# Altium schematic sheet Schenatic_Board.SchDoc
size 431 x 279 mm; SheetNumber: 1; SheetTotal: 1
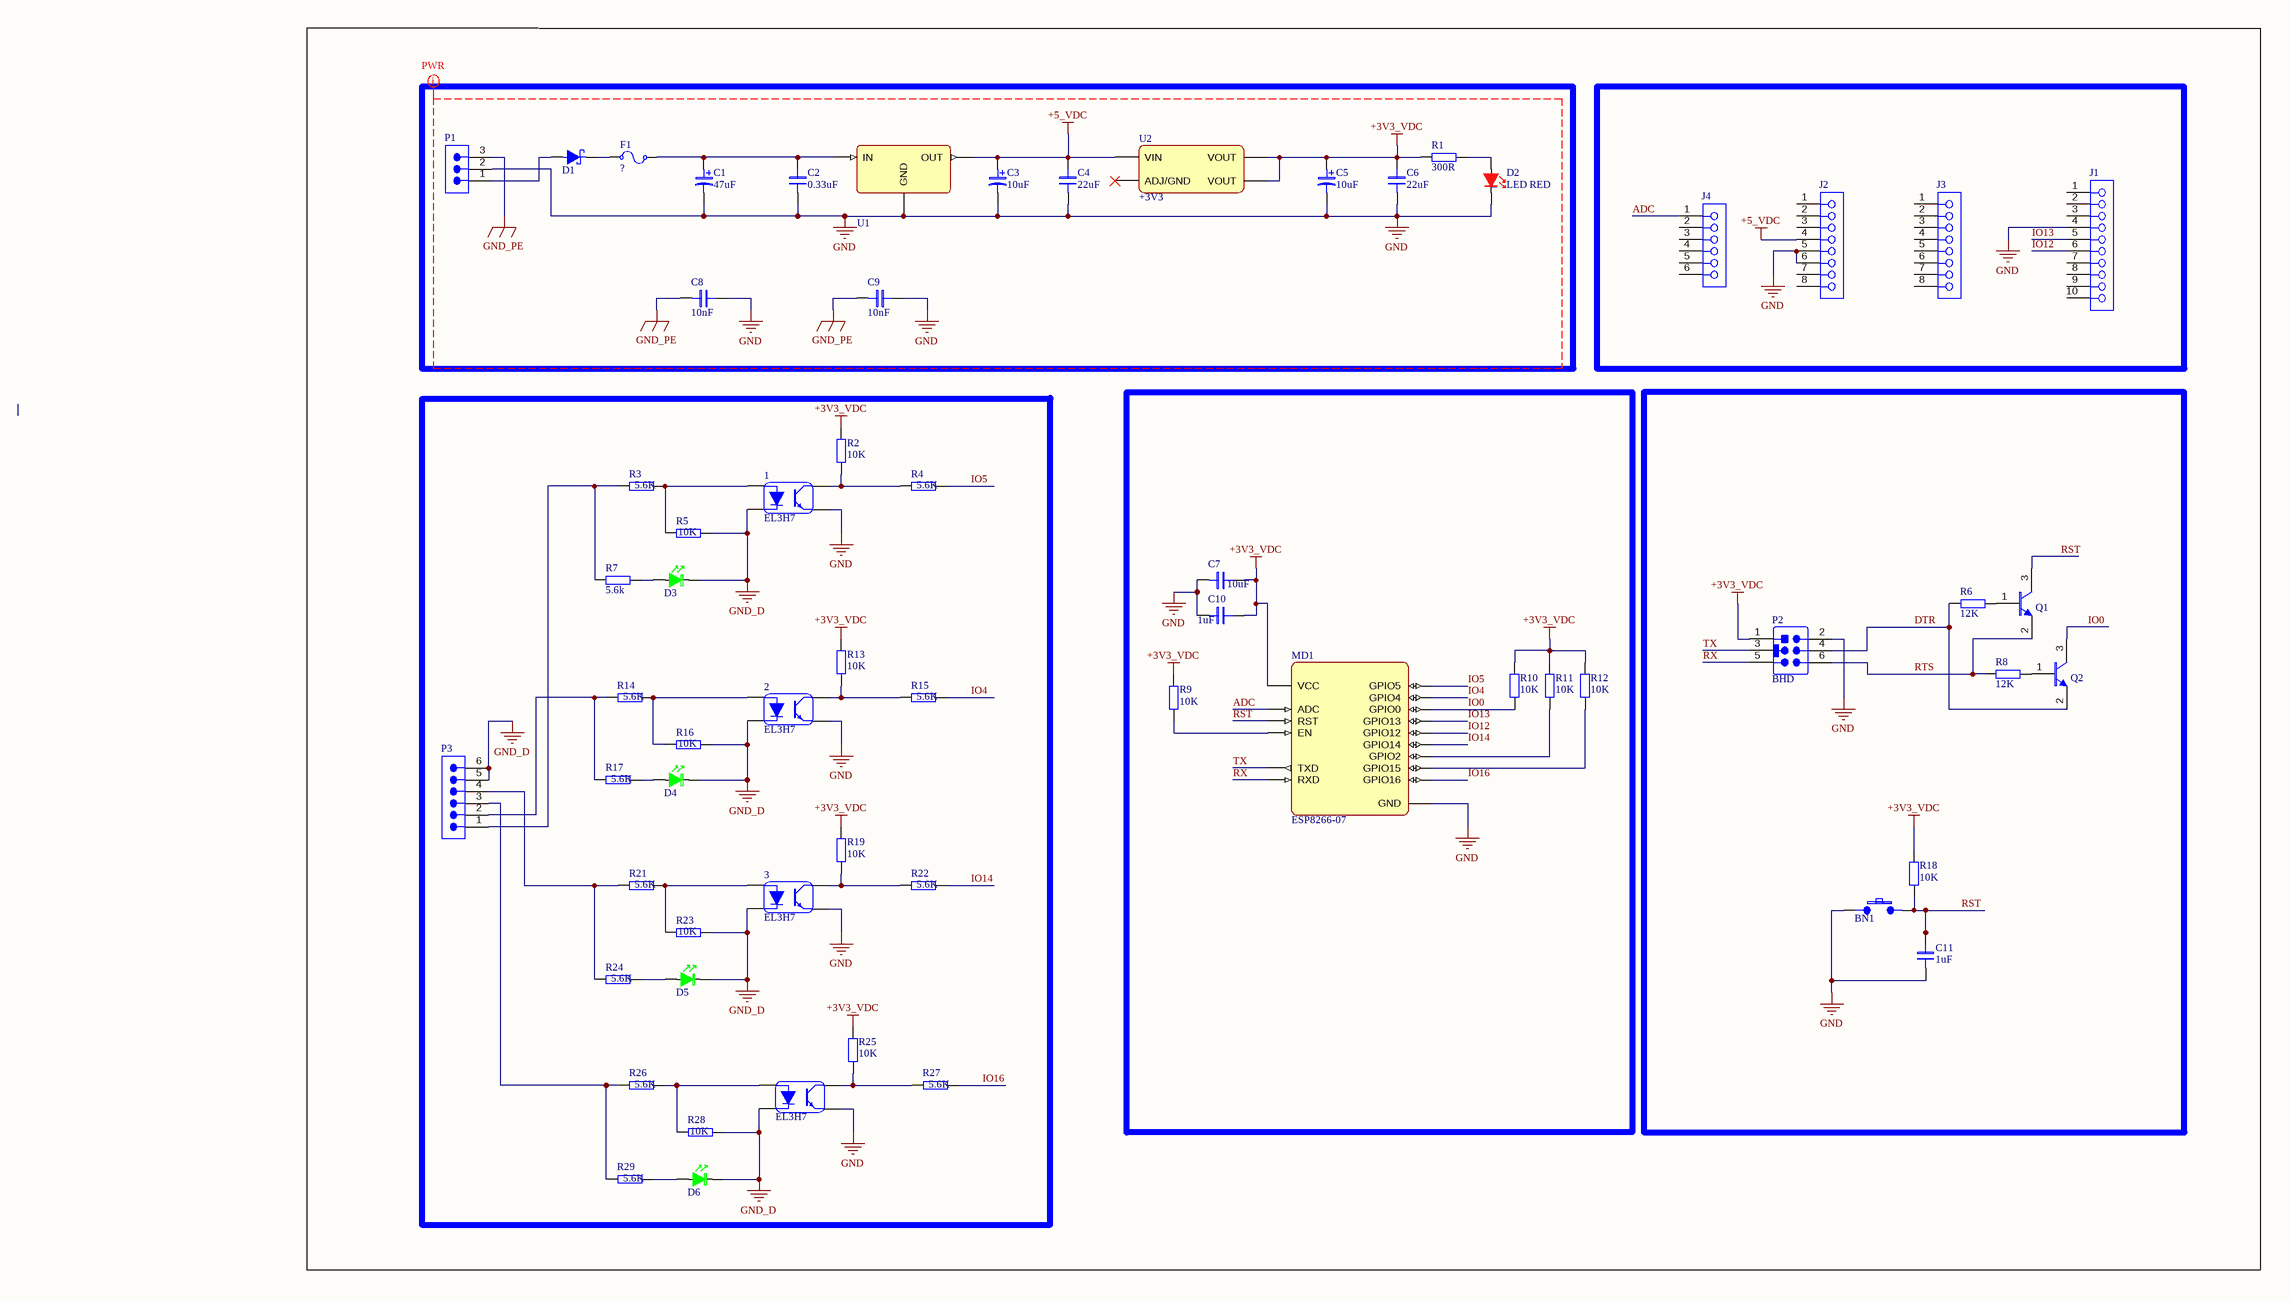
[diagram p0: Schenatic_Board.SchDoc]

## Parts
1  EL3H7  [OPT_EL3H7]
2  EL3H7  [OPT_EL3H7]
3  EL3H7  [OPT_EL3H7]
?  EL3H7  [OPT_EL3H7]
BN1  SKRPABE010  [BTN_SKRPABE010]  (value not drawn)
C1  47uF  [CAPA_D63]
C2  0.33uF  [CAPC_0805]
C3  10uF  [CAPT_1206]
C4  22uF  [CAPC_0805]
C5  10uF  [CAPT_1206]
C6  22uF  [CAPC_0805]
C7  10uF  [CAPC_0805]
C8  10nF  [CAPC_HV10]
C9  10nF  [CAPC_HV10]
C10  1uF  [CAPC_0805]
C11  1uF  [CAPC_0805]
D1  SS34  [DIO-SMA]  (value not drawn)
D2  LED RED  [LED_RED_V0805]
D3  Green LED  [LED-GREEN-3MM]  (value not drawn)
D4  Green LED  [LED-GREEN-3MM]  (value not drawn)
D5  Green LED  [LED-GREEN-3MM]  (value not drawn)
D6  Green LED  [LED-GREEN-3MM]  (value not drawn)
F1  ?  [FUS-PPTC1812]
J1  61301011821  [61301011821]  (value not drawn)
J2  61300811821  [61300811821]  (value not drawn)
J3  61300811821  [61300811821]  (value not drawn)
J4  61300611821  [61300611821]  (value not drawn)
MD1  ESP8266-07  [MD-ESP8266-07]
P1  691322310003  [691322310003]  (value not drawn)
P2  BHD  [CON-BHD-06254-VDM]
P3  691322310006  [691322310006]  (value not drawn)
Q1  BC846x  [BJT_ BC846x]  (value not drawn)
Q2  BC846x  [BJT_ BC846x]  (value not drawn)
R1  300R  [RES_0805]
R2  10K  [RES_0805]
R3  5.6K  [RES_0805]
R4  5.6K  [RES_0805]
R5  10K  [RES_0805]
R6  12K  [RES_0805]
R7  5.6k  [RES_0805]
R8  12K  [RES_0805]
R9  10K  [RES_0805]
R10  10K  [RES_0805]
R11  10K  [RES_0805]
R12  10K  [RES_0805]
R13  10K  [RES_0805]
R14  5.6K  [RES_0805]
R15  5.6K  [RES_0805]
R16  10K  [RES_0805]
R17  5.6K  [RES_0805]
R18  10K  [RES_0805]
R19  10K  [RES_0805]
R21  5.6K  [RES_0805]
R22  5.6K  [RES_0805]
R23  10K  [RES_0805]
R24  5.6K  [RES_0805]
R25  10K  [RES_0805]
R26  5.6K  [RES_0805]
R27  5.6K  [RES_0805]
R28  10K  [RES_0805]
R29  5.6K  [RES_0805]
U1  L7805ACD2T  [L7805ACD2T]  (value not drawn)
U2  +3V3  [LD1117_SOT223]

## Nets
+3V3_VDC: C5.1(P) C6.2 C7.2 C10.2 MD1.8(VCC) P2.1 R1.2 R2.2 R9.2 R10.2 R11.2 R12.2 R13.2 R18.2 R19.2 R25.2 U2.2(VOUT) U2.4(VOUT)
+5_VDC: C3.1(P) C4.2 J2.4 U1.3(OUT) U2.3(VIN)
GND: 1.3 2.3 3.3 ?.3 BN1.12 C1.2(N) C2.1 C3.2(N) C4.1 C5.2(N) C6.1 C7.1 C8.2 C9.2 C10.1 C11.1 D2.C J1.4 J2.5 J2.6 MD1.9(GND) P1.2 P2.2 U1.4(GND)
GND_D: 1.2 2.2 3.2 ?.2 D3.C D4.C D5.C D6.C P3.5 P3.6 R5.2 R16.2 R23.2 R28.2
GND_PE: C8.1 C9.1 P1.3
ADC: J4.1 MD1.2(ADC)
DTR: P2.4 Q2.2(E) R6.2
IO0: MD1.12(GPIO0) Q2.3(C) R10.1
IO4: MD1.13(GPIO4) R15.1
IO5: MD1.14(GPIO5) R4.1
IO12: J1.6 MD1.6(GPIO12)
IO13: J1.5 MD1.7(GPIO13)
IO14: MD1.5(GPIO14) R22.1
IO16: MD1.4(GPIO16) R27.1
RST: BN1.34 C11.2 MD1.1(RST) Q1.3(C) R18.1
RTS: P2.6 Q1.2(E) R8.2
RX: MD1.15(RXD) P2.5
TX: MD1.16(TXD) P2.3
Net1_1: 1.1 R3.1 R5.1
Net1_4: 1.4 R2.1 R4.2
Net2_1: 2.1 R14.1 R16.1
Net2_4: 2.4 R13.1 R15.2
Net3_1: 3.1 R21.1 R23.1
Net3_4: 3.4 R19.1 R22.2
Net?_1: ?.1 R26.1 R28.1
Net?_4: ?.4 R25.1 R27.2
NetC1_1: C1.1(P) C2.2 F1.1 U1.1(IN)
NetD1_A: D1.A P1.1
NetD1_C: D1.C F1.1
NetD2_A: D2.A R1.1
NetD3_A: D3.A R7.1
NetD4_A: D4.A R17.1
NetD5_A: D5.A R24.1
NetD6_A: D6.A R29.1
NetMD1_3: MD1.3(EN) R9.1
NetMD1_10: MD1.10(GPIO15) R12.1
NetMD1_11: MD1.11(GPIO2) R11.1
NetP3_1: P3.1 R3.2 R7.2
NetP3_2: P3.2 R14.2 R17.2
NetP3_3: P3.3 R26.2 R29.2
NetP3_4: P3.4 R21.2 R24.2
NetQ1_1: Q1.1(B) R6.1
NetQ2_1: Q2.1(B) R8.1

Not connected (* = marked no-connect by the designer): J1 1 2 3 7 8 9 10; J2 1 2 3 7 8; J3 1 2 3 4 5 6 7 8; J4 2 3 4 5 6; U2 1(ADJ/GND)*

## Layout directives
net class PWR: +3V3_VDC, +5_VDC, GND, GND_PE

## Library data of the parts
1-3 ? = OPT_EL3H7: 80V 3750V 50mA 0.1V@1mA,10mA 1 6V 1.2V DC SOP-4-1.27mm Optocouplers - Phototransistor Output ROHS; Mfr. Part: EL3H7(A)(TA)-G; JLCPCB Part: ?; LCSC Part: C181879
BN1 = BTN_SKRPABE010: 3.2mm 2.5mm button 50mA Brick SPST 16V SMD Tactile Switches; Mfr. Part: SKRPABE010; JLCPCB Part: ?; LCSC Part: ?
C1 = CAPA_D63: Dia(6.30mm) CAP ALUM SMD; Voltage: 35V; Mouser Part: ?; LCSC Part: C7469958; Mfr. Part: ?; Value: 47uF; Digikey Part: ?
C2 = CAPC_0805: 0805 Multilayer Ceramic Capacitors MLCC - SMD/SMT ROHS; Mfr. Part: YAGEO; LCSC Part: C107132; Mouser Part: ?; Value: 0.33uF; Voltage: ?; Digikey Part: ?
C3 C5 = CAPT_1206: 1206 Tantalum capacitor TAJ/TPS series SMD/SMT ROHS; Mfr. Part: Kyocera AVX; Mouser Part: ?; LCSC Part: C2162859; Voltage: ?; Value: 10uF; Digikey Part: ?
C4 C6 = CAPC_0805: 0805 Multilayer Ceramic Capacitors MLCC - SMD/SMT ROHS; Mfr. Part: Murata Electronics; LCSC Part: C86816; Mouser Part: ?; Value: 22uF; Voltage: ?; Digikey Part: ?
C7 C10 C11 = CAPC_0805: 0805 Multilayer Ceramic Capacitors MLCC - SMD/SMT ROHS; Mfr. Part: Samsung Electro-Mechanics; Mouser Part: ?; Voltage: ?; Digikey Part: ?
  C7: LCSC Part: C1713; Value: 10uF
  C10 C11: LCSC Part: C24123; Value: 1uF
C8 C9 = CAPC_HV10: Through Hole Ceramic Capacitors ROHS Plugin,P=10mm Y5V; Mrf. Part: CK45-E3FD103MYNNA; LCSC Part: C342577; Mouser Part: ?; Digikey Part: ?; Value: 10nF; Voltage: ?
D1 = DIO-SS34: 40V 500mV@3A 3A SMC (SBD); Mfr. Part: SS34; DigiKey Part: ?; LCSC Part: C154551; Mouser Part: ?
D2 = LED_RED_V0805: 20mA 615nm~630nm RED; Mrf. Part: XL-2012SURC; JLCPCB Part: ?; LCSC Part: C965812
D3-D6 = LED-GREEN-3MM: Green LED 3mm, THD; Mfr. Part: LTL1KHGH7J-0K1A; Mouser Part: ?; LCSC Part: C7435543; DigiKey Part: ?
F1 = FUS-PPTC1812: 1812 Resettable Fuses; Mouser Part: ?; LCSC Part: ?; Mfr. Part: ?; Hold Current: ?; Trip Current: ?; DigiKey Part: ?
J1 = CMP-1502-01332-3: Mrf. Part: Wurth Elektronik; LCSC Part: ?; JLCPCB: ?; Mouser Part: 710-61301011821; Digikey Part: ?
J2 = CMP-1502-01327-3: Mrf. Part: Wurth Elektronik; JLCPCB: ?; LCSC Part: ?; Mouser Part: 710-61300811821; Digikey Part: 732-61300811821-ND
J3 = CMP-1502-01327-3: Mrf. Part: Würth Elektronik; LCSC Part: ?; JLCPCB: ?; Mouser Part: 710-61300811821; Digikey Part: 732-61300811821-ND
J4 = CMP-1502-01322-3: Mrf. part: Würth Elektronik; LCSC Part: ?; JLCPCB: ?; Mouser Part: ?; Digikey Part: 732-61300611821-ND
MD1 = MD-ESP8266-07: Core ESP8622EX, Wi-Fi 2.4 GHz, support WPA/WPA2; Mrf. Part: ?; LCSC Part: ?; JLCPCB: ?; Mouser Part: ?; Digikey Part: ?
P1 = CMP-1502-01887-2: Mrf. Part: WJ15EDGRC-3.81-3P; LCSC Part: C8406; JLCPCB: ?; Mouser Part: ?; Digikey Part: ?
P2 = CON-BHD-06254-VDM: 6P 2.54mm Vertical Male Box Header; Mfr. Part: BH254V-6P; LCSC Part: C492441; Mouser Part: ?; DigiKey part: ?
P3 = CMP-1502-01890-2: LCSC Part: C7246; JLCPCB: ?; Mrf. Part: ?; Mouser Part: ?; Digikey Part: ?
Q1 Q2 = BJT_ BC846x: Single Bipolar Transistor, NPN, 65 V, 100 mA, 250 mW, SOT23 (TO-236AB), 3 Pins, Surface Mount; Mfr. Part: BC846B; LCSC Part: C5338312; JLCPCB Part: ?
R1-R19 R21-R29 = RES_0805: 0805 Thick Film Resistor - Surface Mount ROHS; Mfr. Part: ?; Mouser Part: ?; Digikey Part: ?
  R1: LCSC Part: C2907318; Value: 300R
  R2 R5 R9-R13 R16 R18 R19 R23 R25 R28: LCSC Part: C2930231; Value: 10K
  R3 R4 R14 R15 R17 R21 R22 R24 R26 R27 R29: LCSC Part: C2907271; Value: 5.6K
  R6 R8: LCSC Part: C2930231; Value: 12K
  R7: LCSC Part: C2907271; Value: 5.6k
U1 = L7805ACD2T: Linear Voltage Regulator IC Positive Fixed 1 Output 1.5A D2PAK; Mrf. Part: L7805ACD2T-TR; LCSC Part: C53236; JLCPCB: ?; Mouser Part: ?; Digikey Part: ?
U2 = LD1117: LDO, 800mA ,SOT223; Mfr. Part: LD1117S33CTR; LCSC Part: C35879; Mouser Part: ?; Value: +3V3; DigiKey Part: ?